# Altium schematic sheet STM32H750-MotherBoard2.SchDoc
size A4; DocumentNumber: 2; SheetNumber: 2; SheetTotal: 2
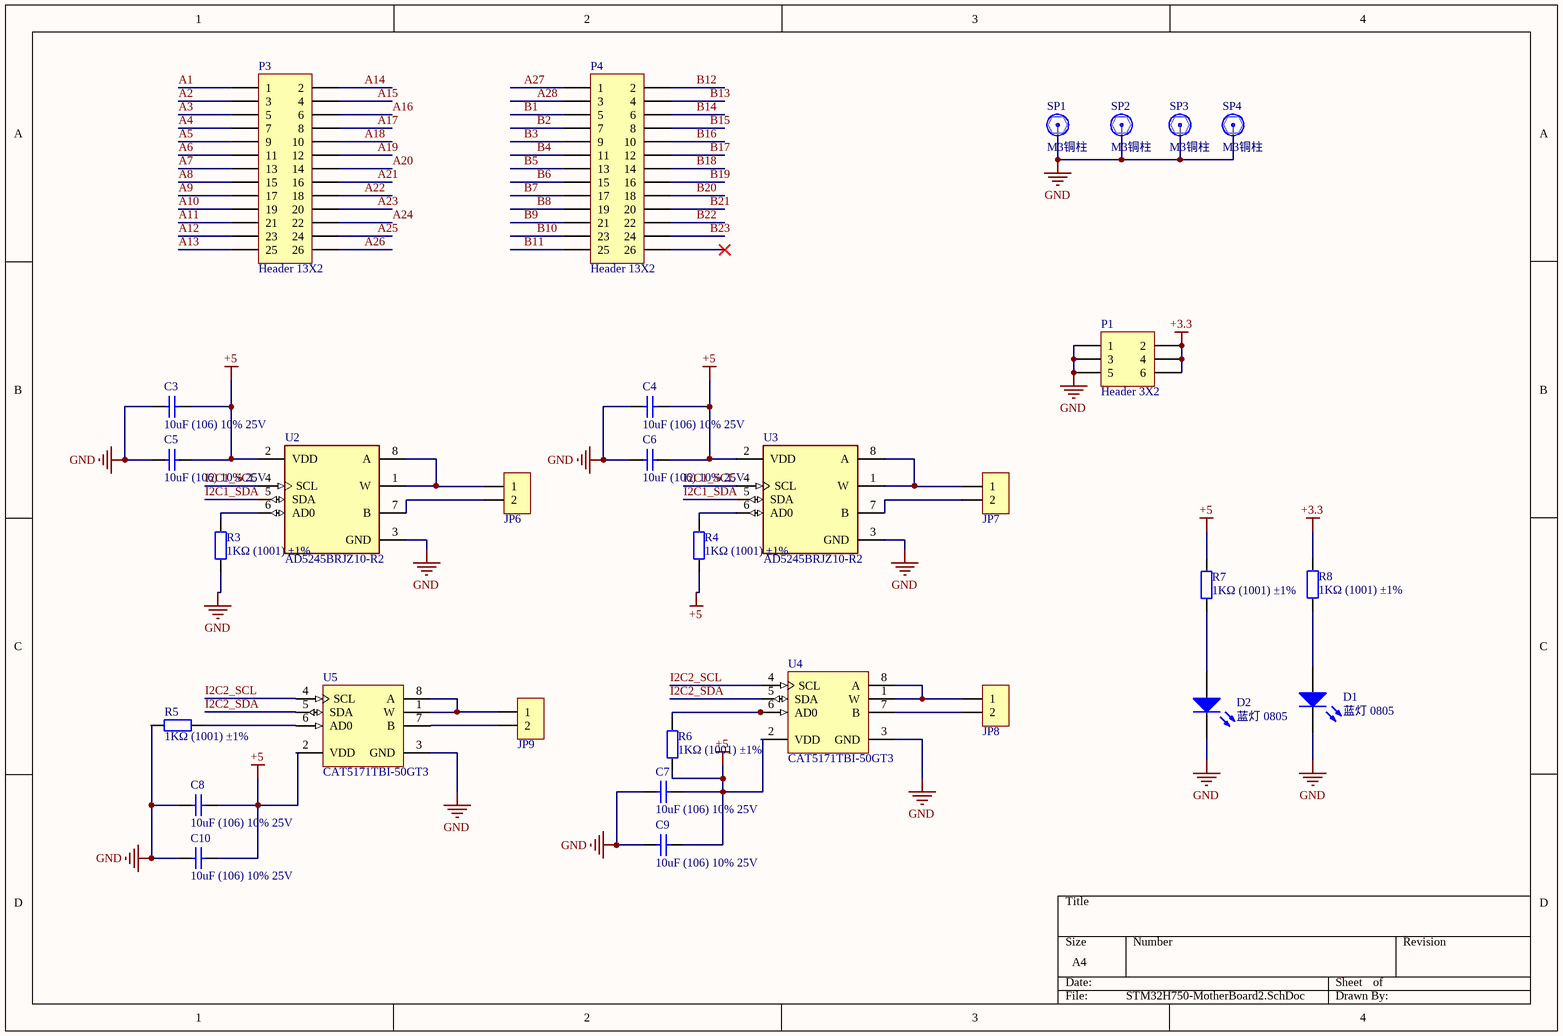
[diagram p0: STM32H750-MotherBoard2.SchDoc]

## Parts
C3  10uF (106) 10% 25V  [0805_C]
C4  10uF (106) 10% 25V  [0805_C]
C5  10uF (106) 10% 25V  [0805_C]
C6  10uF (106) 10% 25V  [0805_C]
C7  10uF (106) 10% 25V  [0805_C]
C8  10uF (106) 10% 25V  [0805_C]
C9  10uF (106) 10% 25V  [0805_C]
C10  10uF (106) 10% 25V  [0805_C]
D1  蓝灯 0805  [0805_LED_S1]
D2  蓝灯 0805  [0805_LED_S1]
JP6  HDR-1X2  [XH2.54-LI-2P]  (value not drawn)
JP7  HDR-1X2  [XH2.54-LI-2P]  (value not drawn)
JP8  HDR-1X2  [XH2.54-LI-2P]  (value not drawn)
JP9  HDR-1X2  [XH2.54-LI-2P]  (value not drawn)
P1  Header 3X2  [HDR2X3]
P3  Header 13X2  [HDR2X13]
P4  Header 13X2  [HDR2X13]
R3  1KΩ (1001) ±1%  [0805_R]
R4  1KΩ (1001) ±1%  [0805_R]
R5  1KΩ (1001) ±1%  [0805_R]
R6  1KΩ (1001) ±1%  [0805_R]
R7  1KΩ (1001) ±1%  [0805_R]
R8  1KΩ (1001) ±1%  [0805_R]
SP1  M3铜柱  [M3x4_L]
SP2  M3铜柱  [M3x4_L]
SP3  M3铜柱  [M3x4_L]
SP4  M3铜柱  [M3x4_L]
U2  AD5245BRJZ10-R2  [FP-RJ-8-IPC_C]
U3  AD5245BRJZ10-R2  [FP-RJ-8-IPC_C]
U4  CAT5171TBI-50GT3  [ONSC-SOT23-8-527AK-01_N]
U5  CAT5171TBI-50GT3  [ONSC-SOT23-8-527AK-01_N]

## Nets
+3.3: P1.2 P1.4 P1.6 R8.2
+5: C3.2 C4.2 C5.2 C6.2 C7.2 C8.2 C9.2 C10.2 R4.1 R6.1 R7.2 U2.2(VDD) U3.2(VDD) U4.2(VDD) U5.2(VDD)
GND: C3.1 C4.1 C5.1 C6.1 C7.1 C8.1 C9.1 C10.1 D1.K D2.K P1.1 P1.3 P1.5 R3.1 R5.1 SP1.1 SP2.1 SP3.1 SP4.1 U2.3(GND) U3.3(GND) U4.3(GND) U5.3(GND)
A1: P3.1
A2: P3.3
A3: P3.5
A4: P3.7
A5: P3.9
A6: P3.11
A7: P3.13
A8: P3.15
A9: P3.17
A10: P3.19
A11: P3.21
A12: P3.23
A13: P3.25
A14: P3.2
A15: P3.4
A16: P3.6
A17: P3.8
A18: P3.10
A19: P3.12
A20: P3.14
A21: P3.16
A22: P3.18
A23: P3.20
A24: P3.22
A25: P3.24
A26: P3.26
A27: P4.1
A28: P4.3
B1: P4.5
B2: P4.7
B3: P4.9
B4: P4.11
B5: P4.13
B6: P4.15
B7: P4.17
B8: P4.19
B9: P4.21
B10: P4.23
B11: P4.25
B12: P4.2
B13: P4.4
B14: P4.6
B15: P4.8
B16: P4.10
B17: P4.12
B18: P4.14
B19: P4.16
B20: P4.18
B21: P4.20
B22: P4.22
B23: P4.24
I2C1_SCL: U2.4(SCL) U3.4(SCL)
I2C1_SDA: U2.5(SDA) U3.5(SDA)
I2C2_SCL: U4.4(SCL) U5.4(SCL)
I2C2_SDA: U4.5(SDA) U5.5(SDA)
NetD1_A: D1.A R8.1
NetD2_A: D2.A R7.1
NetJP6_1: JP6.1 U2.1(W) U2.8(A)
NetJP6_2: JP6.2 U2.7(B)
NetJP7_1: JP7.1 U3.1(W) U3.8(A)
NetJP7_2: JP7.2 U3.7(B)
NetJP8_1: JP8.1 U4.1(W) U4.8(A)
NetJP8_2: JP8.2 U4.7(B)
NetJP9_1: JP9.1 U5.1(W) U5.8(A)
NetJP9_2: JP9.2 U5.7(B)
NetR3_2: R3.2 U2.6(AD0)
NetR4_2: R4.2 U3.6(AD0)
NetR5_2: R5.2 U5.6(AD0)
NetR6_2: R6.2 U4.6(AD0)

Not connected (* = marked no-connect by the designer): P4 26*

## Library data of the parts
C3-C10 = 0805 10uF (106) 10% 25V: 贴片电容; ComponentLink1Description: 供应商链接; ComponentLink1URL: http://www.szlcsc.com/product/details_16532.html; Package: 0805; Supplier: LC; SuppliersPartNumber: C15850
D1 D2 = 0805 蓝灯: 发光二极管; ComponentLink1Description: 供应商链接; ComponentLink1URL: http://www.szlcsc.com/product/details_2666.html; Package: 0805; Supplier: LC; SuppliersPartNumber: C2293
JP6-JP9 = Header 2: 2P接插件; BOM名称: 2P接插件
P1 = Header 3X2: Header, 3-Pin, Dual row; LatestRevisionDate: 17-Jul-2002; LatestRevisionNote: Re-released for DXP Platform.; Publisher: Altium Limited
P3 P4 = Header 13X2: Header, 13-Pin, Dual row; LatestRevisionDate: 17-Jul-2002; LatestRevisionNote: Re-released for DXP Platform.; Publisher: Altium Limited
R3-R8 = 0805 1KΩ (1001) 1%: 贴片电阻; ComponentLink1Description: 供应商链接; ComponentLink1URL: http://www.szlcsc.com/product/details_18201.html; Package: 0805; Supplier: LC; SuppliersPartNumber: C17513
SP1-SP4 = 铜柱小焊盘: 铜柱; BOM名称: 铜柱
U2 U3 = CMP-09083-000005-1: IC DGT POT 10KOHM 256TAP SOT23-8; Manufacturer: Analog Devices; Interface: I2C; Nominal Resistance: 10kΩ; Nominal Supply Current: 3uA; Tolerance: 30%; Max Junction Temp: +150°C; Standoff Height: 0.05mm; Number Of Taps: 256; Number Of Circuits: 1; Min Supply Voltage: 2.7V; Max Supply Voltage: 5.5V; Temperature Coefficient: 45ppm/°C; Footprint Url: https://www.analog.com/media/en/package-pcb-resources/package/pkg_pdf/sot-23rj/RJ_8.pdf; Height: 1.45mm; Temperature Range Low: -40°C; Category: IC; Temperature: -40°C to +125°C; ComponentLink2URL: https://www.analog.com/media/en/technical-documentation/data-sheets/AD5245.pdf; Automotive: No; Lead Free: Yes; ComponentLink2Description: Datasheet; Device Class L2: Data Converter ICs; Digikey Description: IC DGT POT 10KOHM 256TAP SOT23-8; Manufacturer Part Number: AD5245BRJZ10-R2; Package: RJ-8; Octopart: https://octopart.com/ad5245brjz10-r2-analog+devices-446714; Ipc Land Pattern Name: SOT65P280X120-8; Device Class L1: Integrated Circuits (ICs); RoHS: TRUE; Temperature Range High: +125°C; Device Class L3: Digital Potentiometers; Mouser Description: Digital Potentiometer ICs IC 256-pos I2C
U4 U5 = CMP-1317-00202-1: 256-Position I2C Compatible Digital Potentiometer (POT), -40 to 85 degC, 8-Pin SOT23, Pb-Free, Tape and Reel; Manufacturer: On Semiconductor; # of Pots: 1; VDD Max (V): 5.5; # of Taps: 256; Code_JEDEC: MO-178; RoHS: TRUE; ComponentLink1URL: http://www.onsemi.com/; ComponentLink3URL: http://www.onsemi.com/pub_link/Collateral/527AK.PDF; PackageDescription: 8-Pin Small Outline Transistor, Body 2.9 x 1.6 mm, Pitch 0.65 mm; ComponentLink3Description: Package Specification; PackageReference: SOT23-8-527AK-01; ComponentLink1Description: Manufacturer URL; PartNumber: CAT5171TBI-50GT3; PackageVersion: Rev. A, 03/2009; Packing: Tape and Reel; DatasheetVersion: Rev. 2; Mounting Technology: Surface Mount; ComponentLink2URL: http://www.onsemi.com/pub_link/Collateral/CAT5171-D.PDF; Control Interface: I2C; Type: Potentiometer; ComponentLink2Description: Datasheet